# Altium schematic sheet Vertap_Power.SchDoc: Power
size A4; Author: Taim Al-Dabbagh; DrawnBy: Taim Al-Dabbagh; Revision: v1; SheetNumber: 2; SheetTotal: 6
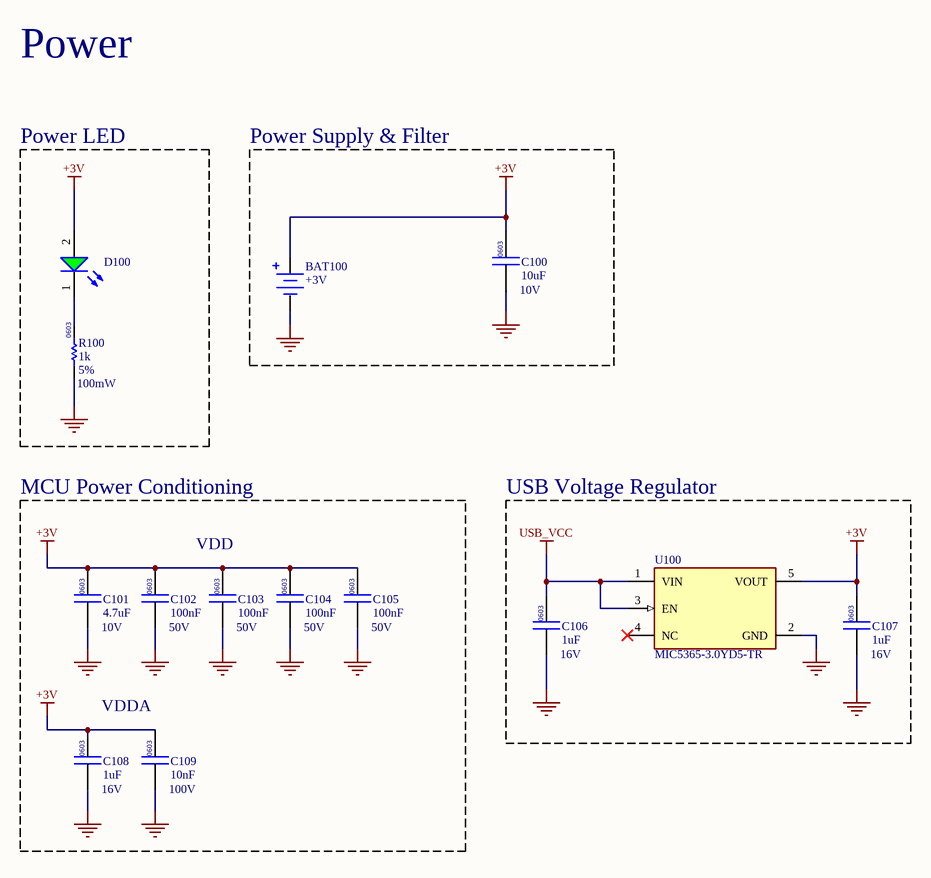
[diagram p0: Vertap_Power.SchDoc]

## Parts
BAT100  +3V  [BH-67D-5]
C100  10uF  [CAP_0603_MURATA]
C101  4.7uF  [CAP_0603_MURATA]
C102  100nF  [CAP_0603_MURATA]
C103  100nF  [CAP_0603_MURATA]
C104  100nF  [CAP_0603_MURATA]
C105  100nF  [CAP_0603_MURATA]
C106  1uF  [CAP_0603_MURATA]
C107  1uF  [CAP_0603_MURATA]
C108  1uF  [CAP_0603_MURATA]
C109  10nF  [CAP_0603_MURATA]
D100  150060VS75000  [WL-SMCW_0603_150060xx75000]  (value not drawn)
R100  1k  [RESC1608X55X25LL10T15]
U100  MIC5365-3.0YD5-TR  [FP-TSOT-5LD-PL-1-MFG]

## Blocks framed on the sheet
Power LED: D100 R100
Power Supply & Filter: BAT100 C100
MCU Power Conditioning: C101-C105 C108 C109
USB Voltage Regulator: C106 C107 U100

## Nets
+3V: BAT100.2(+) C100.1 C101.1 C102.1 C103.1 C104.1 C105.1 C107.1 C108.2 C109.1 D100.2(A) U100.5(VOUT)
GND: BAT100.1(-) C100.2 C101.2 C102.2 C103.2 C104.2 C105.2 C106.2 C107.2 C108.1 C109.2 R100.1 U100.2(GND)
USB_VCC: C106.1 U100.1(VIN) U100.3(EN)
NetD100_1: D100.1(K) R100.2

Not connected (* = marked no-connect by the designer): U100 4(NC)*

## Notes on the sheet
- Power
- (near C100) 0603
- (near C100) 10V
- (near R100) 0603
- (near R100) 100mW
- (near R100) 5%
- (near C101) 0603
- (near C102) 0603
- VDD
- (near C103) 0603
- (near C104) 0603
- (near C105) 0603
- (near C101) 10V
- (near C102) 50V
- (near C103) 50V
- (near C104) 50V
- (near C105) 50V
- (near C106) 0603
- (near C106) 16V
- (near C107) 0603
- (near C107) 16V
- VDDA
- (near C108) 0603
- (near C108) 16V
- (near C109) 0603
- (near C109) 100V

## Library data of the parts
BAT100 = BH-67D-5: BATT RETAINER COIN 20MM 1CEL SMD; Supplier 1: Digi-Key; Supplier Part Number 1: 2057-BH-67D-5-ND
C100 = CAP_10uF_0603: CAP CER 10UF 10V X7R 0603; Supplier 1: Arrow Electronics; Supplier Part Number 1: GRM188Z71A106KA73D
C101 = CAP_4.7uF_0603: CAP CER 4.7UF 10V X7R 0603; Supplier 1: Digi-Key
C102-C105 = CAP_0.1uF_0603: CAP CER 0.1UF 50V X7R 0603; Supplier 1: Mouser; Supplier Part Number 1: 81-GCM188R71H104JA7D
C106-C108 = CAP_1uF_0603: CAP CER 1UF 16V X7R 0603; Supplier 1: Arrow Electronics
  C106 C107: Supplier Part Number 1: GCM188R71C105KA64J
C109 = CAP_10nF_0603: CAP CER 10000PF 100V X7R 0603; Supplier 1: Arrow Electronics; Supplier Part Number 1: GCM188R72A103KA37J
D100 = CMP-1426-00006-6: NexarPartId: 29717778; Reverse Voltage: 5V; Forward Voltage: 2V; Viewing Angle: 140°; Luminous Intensity: 40mcd; Test Current: 20mA; Max Junction Temperature (Tj): 95°C; Wavelength: 570nm; Forward Current: 100mA; Color: Green; Lens Style: Clear, Rectangular; Power Dissipation: 72mW; Peak Wavelength: 572nm; Packaging: Tape and Reel; REACH SVHC: Unknown; Width: 800µm; Max Operating Temperature: 85°C; Number of Pins: 2; RoHS: Compliant; Dominant Wavelength: 570nm; Min Operating Temperature: -40°C; Case Code (Imperial): 0603; Height: 700µm; Length: 1.6mm; Case Code (Metric): 1608; Case/Package: 0603; Max Reverse Voltage (DC): 5V; Mount: Surface Mount
R100 = CMP-2000-04305-1: Manufacturer: Yageo; Part Number: RC0603JR-101KL
U100 = CMP-00252-66803206-1: MIC5365-3.0YD5-TR LDO Regulator Pos 3V 0.15A 5-Pin TSOT-23 T/R; Min Supply Voltage: 2.5V; Max Supply Voltage: 5.5V; Dropout Voltage: 155mV; Min Current Limit: 200mA; Max Junction Temperature (Tj): 125°C; Output Current: 150mA; Number of Outputs: 1; Accuracy: 2%; Mount: Surface Mount; NexarPartId: 66803206; Lifecycle Status: Production; Min Operating Temperature: -40°C; Height: 1mm; RoHS: Compliant; Max Operating Temperature: 125°C; Number of Regulators: 1; Case/Package: SOT-23-5; Output Voltage: 3V